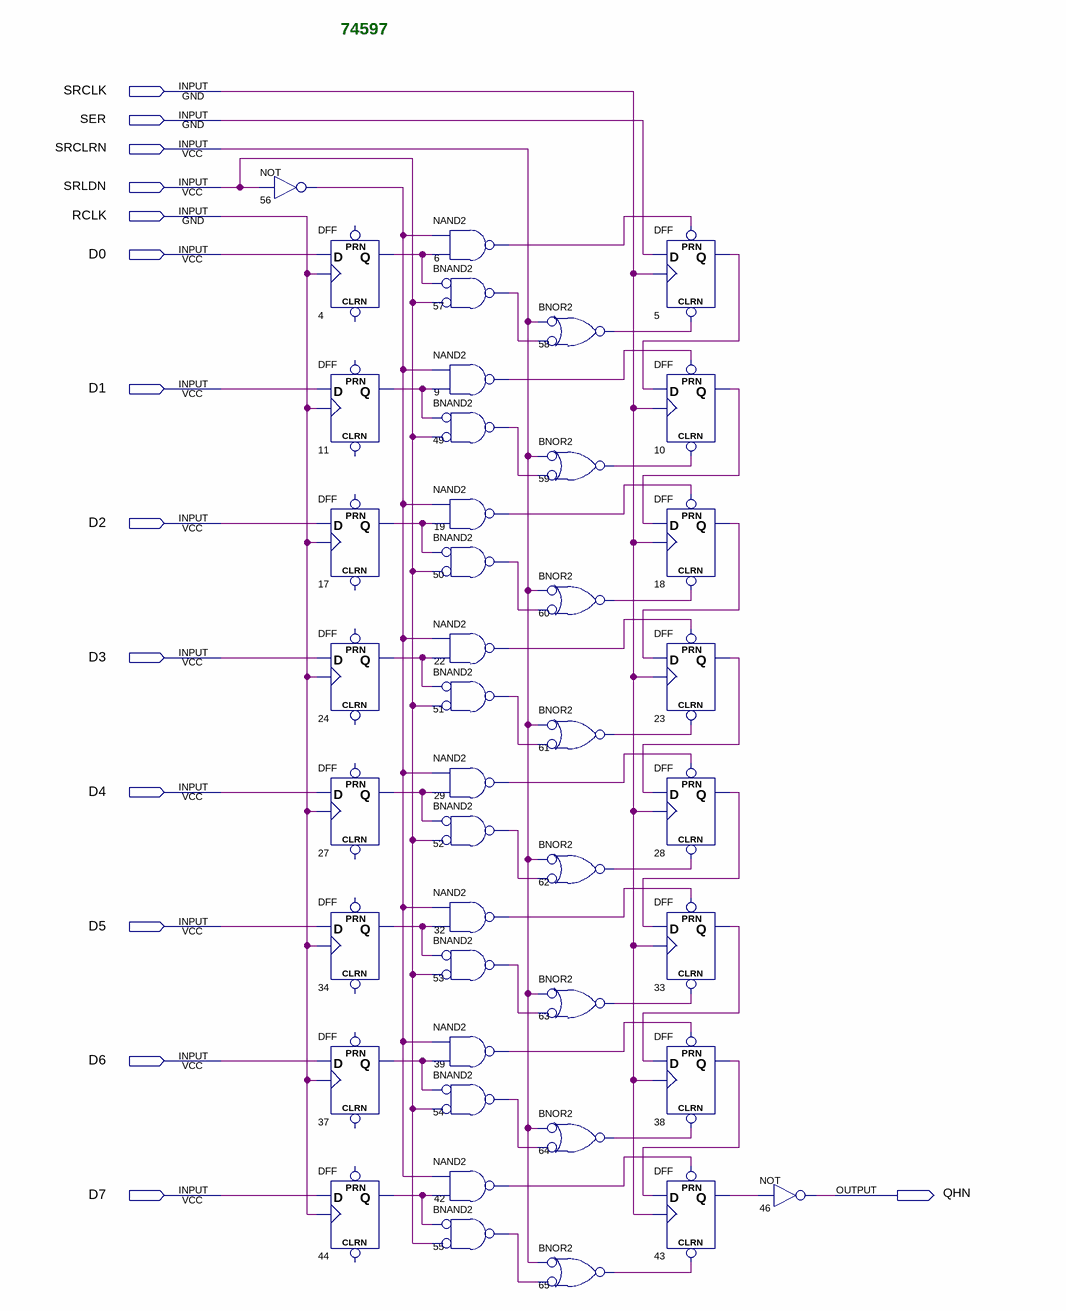
[diagram p0: schematic sheet]
// Quartus schematic 74597.bdf as structural Verilog: 42 symbols, 14 pins
module \74597  (
  input  SRCLK,
  input  SER,
  input  SRCLRN,
  input  SRLDN,
  input  RCLK,
  input  D0,
  input  D1,
  input  D2,
  input  D3,
  input  D4,
  input  D5,
  input  D6,
  input  D7,
  output QHN
);

  wire n4_q, n5_q, n6_out, n9_out, n10_q, n11_q, n17_q, n18_q, n19_out, n22_out, n23_q, n24_q, n27_q, n28_q,
       n29_out, n32_out, n33_q, n34_q, n37_q, n38_q, n39_out, n42_out, n43_q, n44_q, n49_out, n50_out,
       n51_out, n52_out, n53_out, n54_out, n55_out, n56_out, n57_out, n58_out, n59_out, n60_out, n61_out,
       n62_out, n63_out, n64_out, n65_out;

  not u_56 (n56_out, SRLDN);
  DFF u_4 (.CLK(RCLK), .D(D0), .Q(n4_q));  // open: CLRN, PRN
  DFF u_11 (.CLK(RCLK), .D(D1), .Q(n11_q));  // open: CLRN, PRN
  DFF u_17 (.CLK(RCLK), .D(D2), .Q(n17_q));  // open: CLRN, PRN
  DFF u_24 (.CLK(RCLK), .D(D3), .Q(n24_q));  // open: CLRN, PRN
  DFF u_27 (.CLK(RCLK), .D(D4), .Q(n27_q));  // open: CLRN, PRN
  DFF u_34 (.CLK(RCLK), .D(D5), .Q(n34_q));  // open: CLRN, PRN
  DFF u_37 (.CLK(RCLK), .D(D6), .Q(n37_q));  // open: CLRN, PRN
  DFF u_44 (.CLK(RCLK), .D(D7), .Q(n44_q));  // open: CLRN, PRN
  nand u_6 (n6_out, n56_out, n4_q);
  nand u_57 (n57_out, ~n4_q, ~SRLDN);  // BNAND2
  nand u_9 (n9_out, n56_out, n11_q);
  nand u_49 (n49_out, ~n11_q, ~SRLDN);  // BNAND2
  nand u_19 (n19_out, n56_out, n17_q);
  nand u_50 (n50_out, ~n17_q, ~SRLDN);  // BNAND2
  nand u_22 (n22_out, n56_out, n24_q);
  nand u_51 (n51_out, ~n24_q, ~SRLDN);  // BNAND2
  nand u_29 (n29_out, n56_out, n27_q);
  nand u_52 (n52_out, ~n27_q, ~SRLDN);  // BNAND2
  nand u_32 (n32_out, n56_out, n34_q);
  nand u_53 (n53_out, ~n34_q, ~SRLDN);  // BNAND2
  nand u_39 (n39_out, n56_out, n37_q);
  nand u_54 (n54_out, ~n37_q, ~SRLDN);  // BNAND2
  nand u_42 (n42_out, n56_out, n44_q);
  nand u_55 (n55_out, ~n44_q, ~SRLDN);  // BNAND2
  nor u_58 (n58_out, ~SRCLRN, ~n57_out);  // BNOR2
  nor u_59 (n59_out, ~SRCLRN, ~n49_out);  // BNOR2
  nor u_60 (n60_out, ~SRCLRN, ~n50_out);  // BNOR2
  nor u_61 (n61_out, ~SRCLRN, ~n51_out);  // BNOR2
  nor u_62 (n62_out, ~SRCLRN, ~n52_out);  // BNOR2
  nor u_63 (n63_out, ~SRCLRN, ~n53_out);  // BNOR2
  nor u_64 (n64_out, ~SRCLRN, ~n54_out);  // BNOR2
  nor u_65 (n65_out, ~SRCLRN, ~n55_out);  // BNOR2
  DFF u_5 (.CLRN(n58_out), .CLK(SRCLK), .D(SER), .PRN(n6_out), .Q(n5_q));
  DFF u_10 (.CLRN(n59_out), .CLK(SRCLK), .D(n5_q), .PRN(n9_out), .Q(n10_q));
  DFF u_18 (.CLRN(n60_out), .CLK(SRCLK), .D(n10_q), .PRN(n19_out), .Q(n18_q));
  DFF u_23 (.CLRN(n61_out), .CLK(SRCLK), .D(n18_q), .PRN(n22_out), .Q(n23_q));
  DFF u_28 (.CLRN(n62_out), .CLK(SRCLK), .D(n23_q), .PRN(n29_out), .Q(n28_q));
  DFF u_33 (.CLRN(n63_out), .CLK(SRCLK), .D(n28_q), .PRN(n32_out), .Q(n33_q));
  DFF u_38 (.CLRN(n64_out), .CLK(SRCLK), .D(n33_q), .PRN(n39_out), .Q(n38_q));
  DFF u_43 (.CLRN(n65_out), .CLK(SRCLK), .D(n38_q), .PRN(n42_out), .Q(n43_q));
  not u_46 (QHN, n43_q);

  // Notes on the sheet:
  //   74597
endmodule
